# EasyEDA schematic main board.json
TITLE: Sheet_1; REV: 1.0; Date: 2021-07-18; Sheet: 1/1; Drawn By: Gustavo Moraes; Company: Your Company
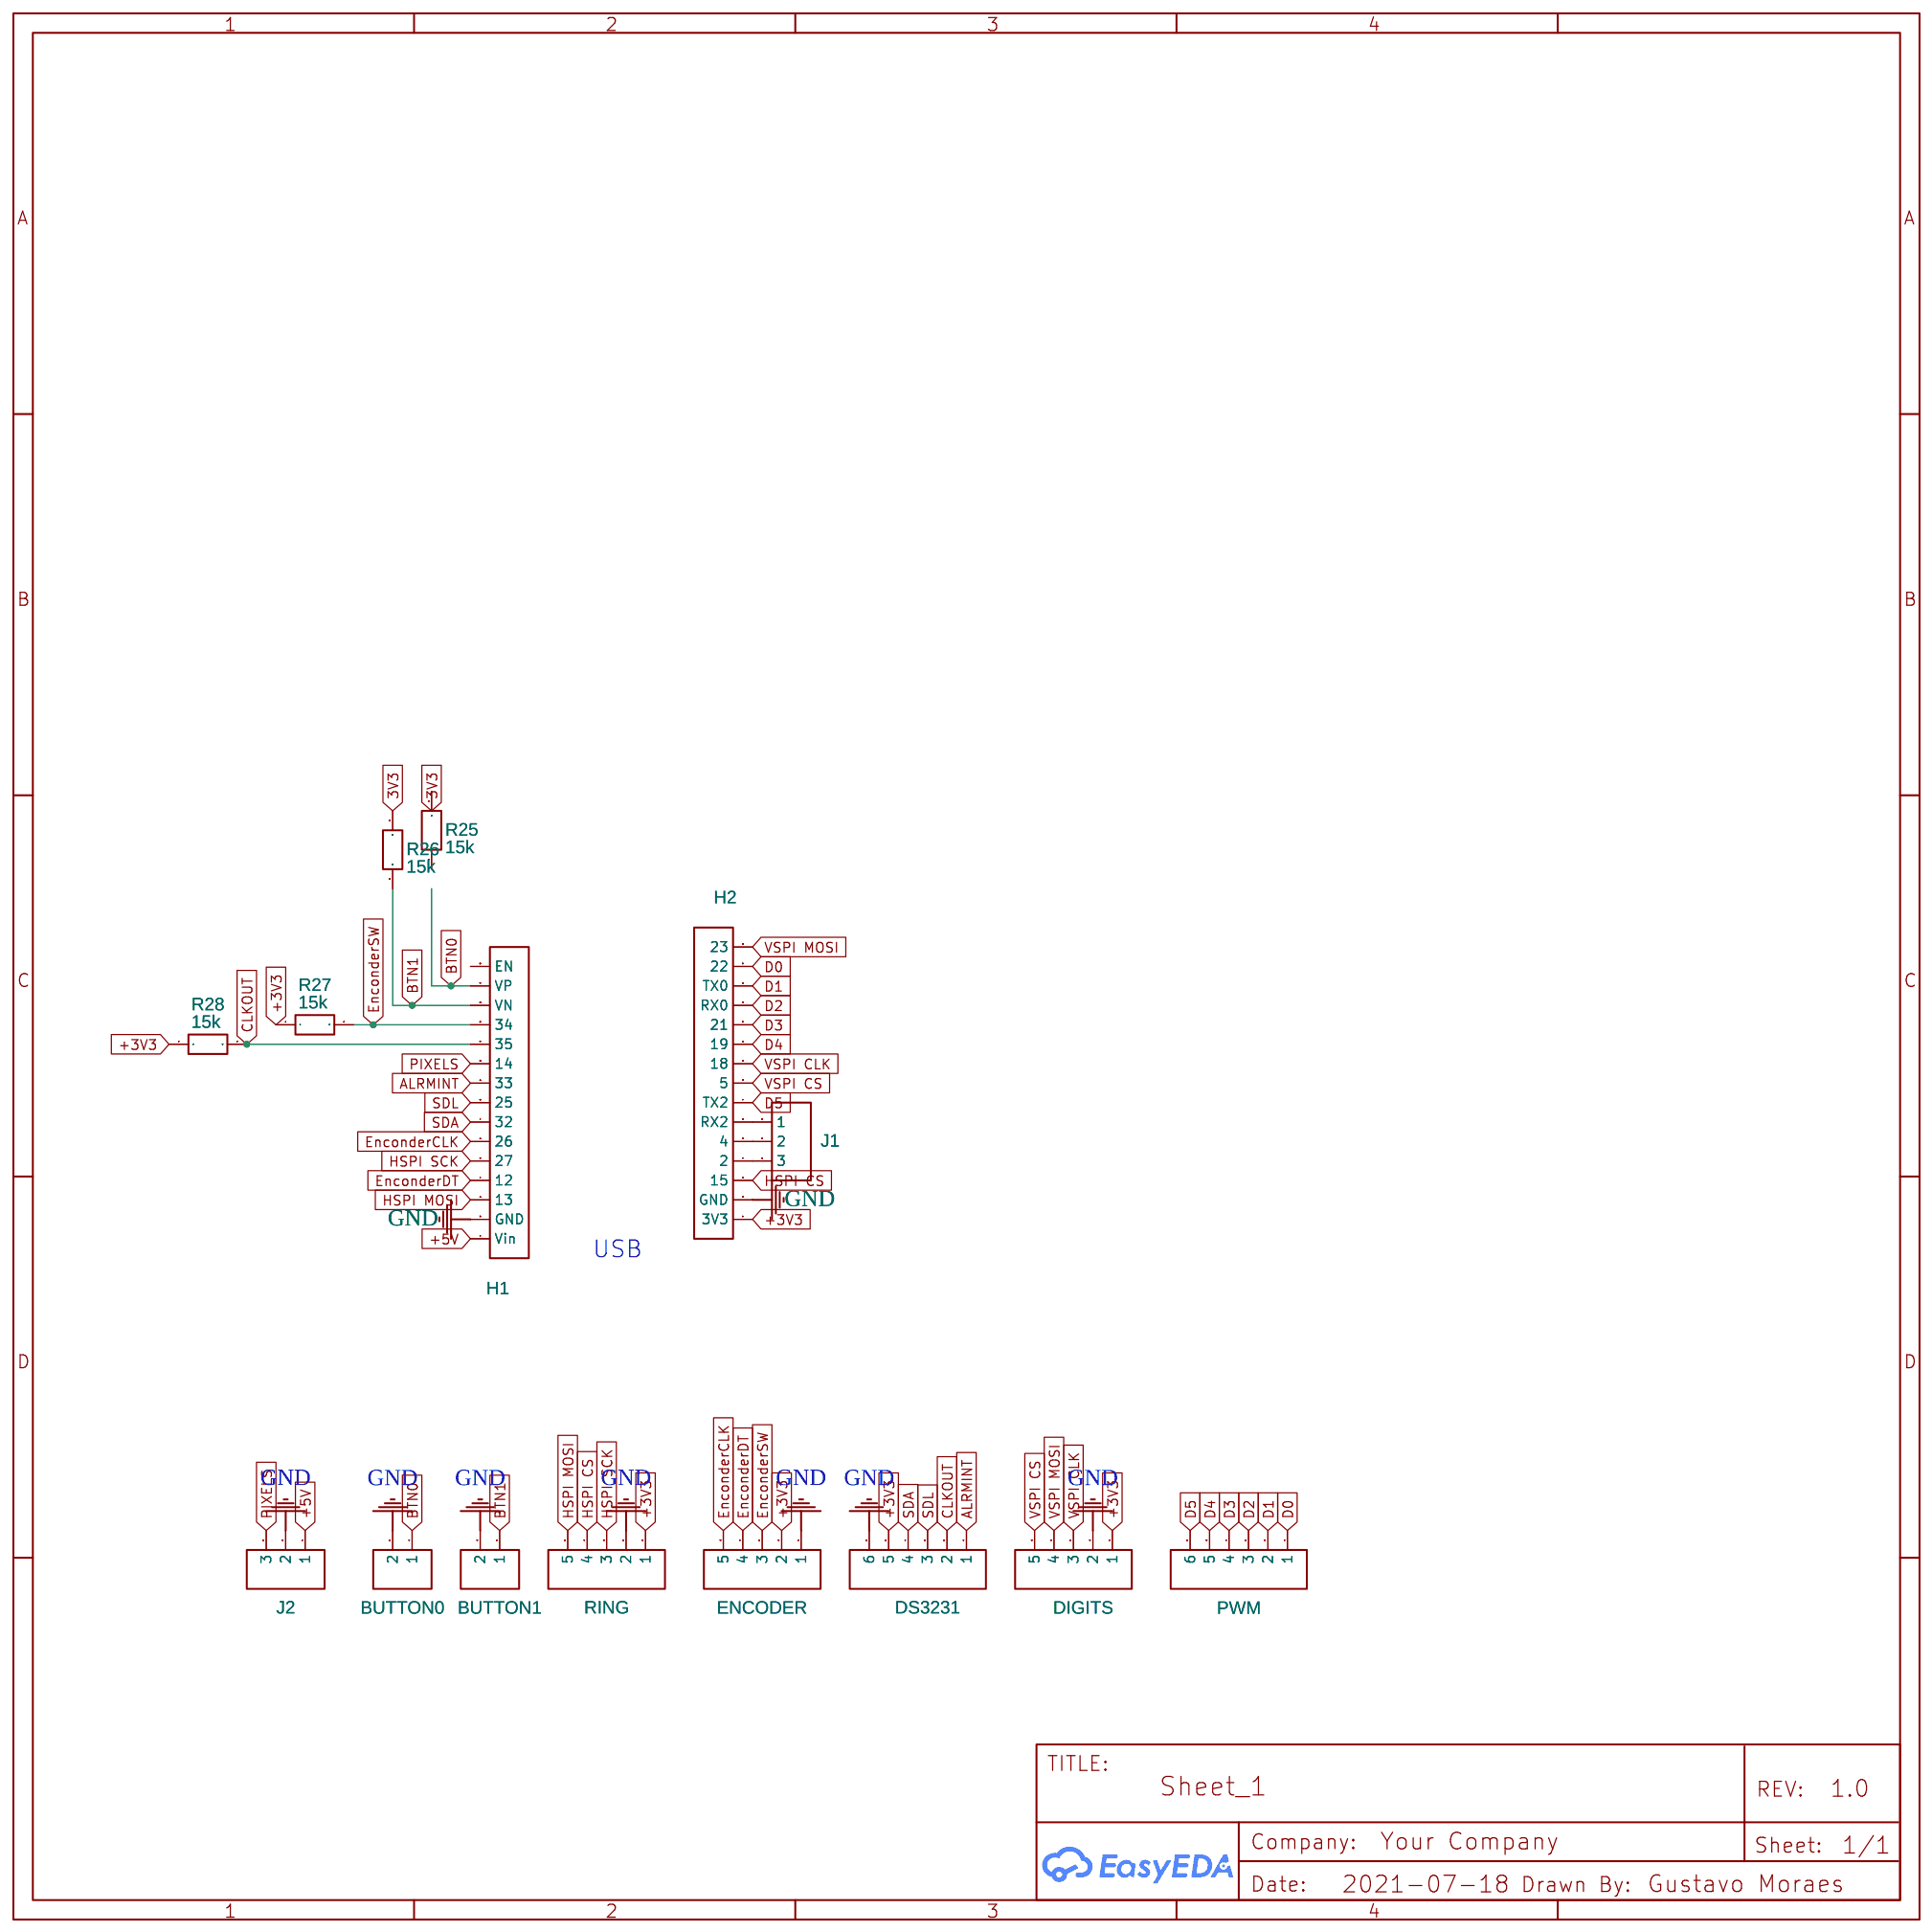
[diagram p0: schematic sheet]

## Parts
BUTTON0  HDR-M-2.54_1x2  [HDR-M-2.54_1X2]
BUTTON1  HDR-M-2.54_1x2  [HDR-M-2.54_1X2]
DIGITS  HDR-M-2.54_1x5  [HDR-M-2.54_1X5]
DS3231  HDR-F-2.54_1x6  [HDR-F-2.54_1X6]
ENCODER  Enconder  [HDR-M-2.54_1X5]
H1  HDR-F-2.54_1x15  [HDR-F-2.54_1X15]
H2  HDR-F-2.54_1x15  [HDR-F-2.54_1X15]
J1  HDR-M-2.54_1x3  [HDR-M-2.54_1X3]
J2  HDR-M-2.54_1x3  [HDR-M-2.54_1X3]
PWM  HDR-M-2.54_1x6  [HDR-M-2.54_1X6]
R25  15k  [R_AXIAL-0.3]
R26  15k  [R_AXIAL-0.3]
R27  15k  [R_AXIAL-0.3]
R28  15k  [R_AXIAL-0.3]
RING  LED Ring  [HDR-M-2.54_1X5]

## Library data of the parts
BUTTON0 BUTTON1 = HDR-M-2.54_1x2: Supplier Part: C124375; Supplier: LCSC; Contributor: LCEDA_Lib
DIGITS ENCODER RING = HDR-M-2.54_1x5: Supplier Part: C358687; Supplier: LCSC; Contributor: LCEDA_Lib
DS3231 = HDR-F-2.54_1x6: Supplier Part: C40877; Supplier: LCSC; Contributor: LCEDA_Lib
H1 H2 = HDR-F-2.54_1x15: Supplier Part: C124408; Supplier: LCSC; Contributor: LCEDA_Lib
J1 J2 = HDR-M-2.54_1x3: Supplier Part: C180248; Supplier: LCSC; Contributor: LCEDA_Lib
PWM = HDR-M-2.54_1x6: Supplier Part: C190819; Supplier: LCSC; Contributor: LCEDA_Lib
R25-R28 = R_AXIAL-0.3_EU: Contributor: LCEDA_Lib

## Nets
3V3: R26.2
+3V3: DIGITS.1 DS3231.5 ENCODER.2 H2.1(3V3) R27.1 R28.1 RING.1
+5V: H1.1(Vin) J2.1
GND: BUTTON0.2 BUTTON1.2 DIGITS.2 DS3231.6 ENCODER.1 H1.2(GND) H2.2(GND) J2.2 RING.2
ALRMINT: DS3231.1 H1.9(33)
BTN0: BUTTON0.1 H1.14(VP)
BTN1: BUTTON1.1 H1.13(VN) R26.1
CLKOUT: DS3231.2 H1.11(35) R28.2
D0: H2.14(22) PWM.1
D1: H2.13(TX0) PWM.2
D2: H2.12(RX0) PWM.3
D3: H2.11(21) PWM.4
D4: H2.10(19) PWM.5
D5: H2.7(TX2) PWM.6
EnconderCLK: ENCODER.5 H1.6(26)
EnconderDT: ENCODER.4 H1.4(12)
EnconderSW: ENCODER.3 H1.12(34) R27.2
HSPI CS: H2.3(15) RING.4
HSPI MOSI: H1.3(13) RING.5
HSPI SCK: H1.5(27) RING.3
PIXELS: H1.10(14) J2.3
SDA: DS3231.4 H1.7(32)
SDL: DS3231.3 H1.8(25)
VSPI CLK: DIGITS.3 H2.9(18)
VSPI CS: DIGITS.5 H2.8(5)
VSPI MOSI: DIGITS.4 H2.15(23)
Net-(H2-4): H2.4(2) J1.3
Net-(H2-5): H2.5(4) J1.2
Net-(H2-6): H2.6(RX2) J1.1

Not connected (* = marked no-connect by the designer): H1 15(EN); R25 1 2

## Notes on the sheet
- USB
